# EAGLE design RH049.2 (EAGLE 7.7.0)
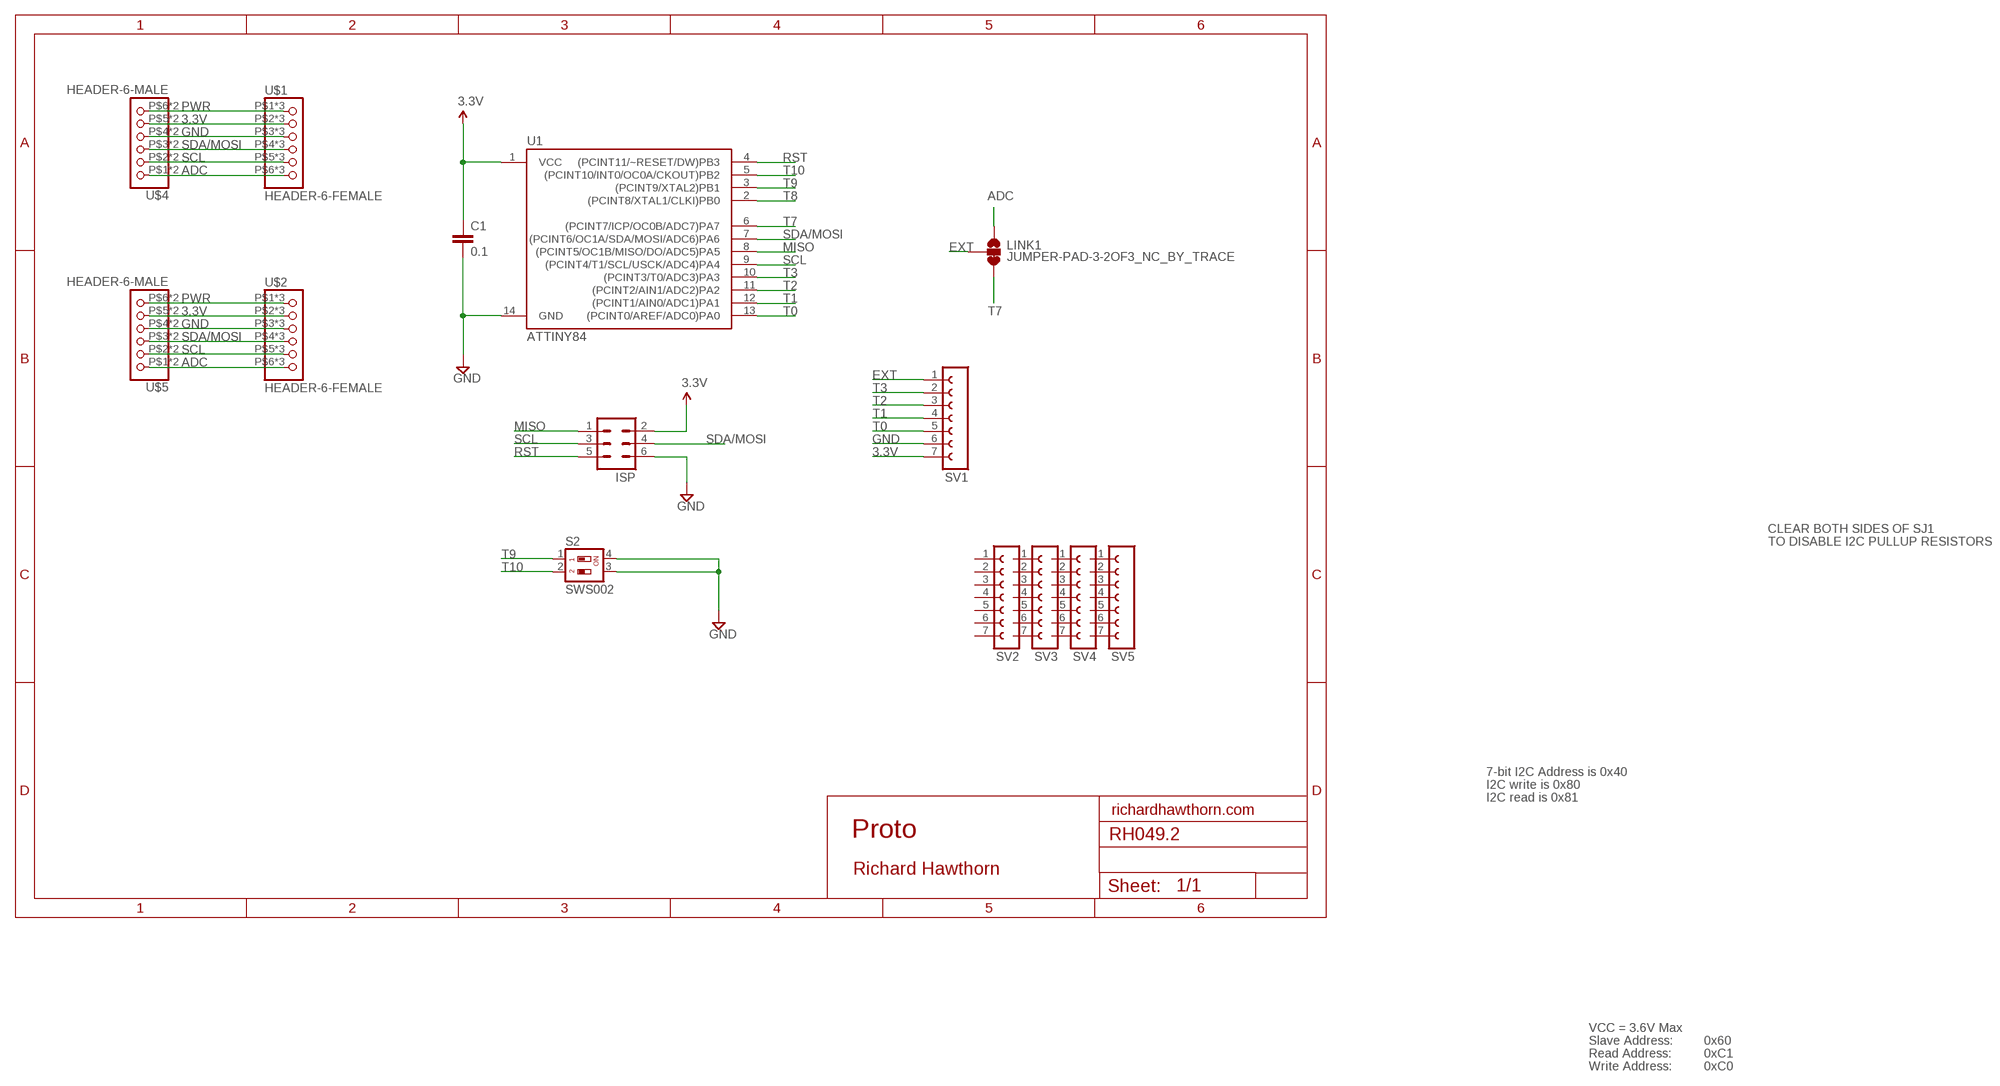
[diagram p0: schematic, sheet 1]

## Parts
C1  0.1  CAP0603-CAP  [0603-CAP]
ISP  MA03-2  [MA03-2]
LINK1  JUMPER-PAD-3-2OF3_NC_BY_TRACE  [PAD-JUMPER-3-2OF3_NC_BY_TRACE_YES_SILK_FULL_BOX]
S2  SWS002  [SMS-002]
SV1  FE07-1  [FE07]
SV2  FE07-1  [FE07]
SV3  FE07-1  [FE07]
SV4  FE07-1  [FE07]
SV5  FE07-1  [FE07]
U1  ATTINY84  [SO14]
U$1  HEADER-6-FEMALE  [2MMHEADER6]
U$2  HEADER-6-FEMALE  [2MMHEADER6]
U$4  HEADER-6-MALE  [2MMHEADERPIN6]
U$5  HEADER-6-MALE  [2MMHEADERPIN6]

## Nets
3.3V: C1.1 ISP.2 SV1.7 U1.1(VCC) U$1.P$2 U$1.P$10 U$1.P$18 U$2.P$2 U$2.P$10 U$2.P$18 U$4.P$5 U$4.P$13 U$5.P$5 U$5.P$13
ADC: LINK1.1 U$1.P$6 U$1.P$14 U$1.P$22 U$2.P$6 U$2.P$14 U$2.P$22 U$4.P$1 U$4.P$9 U$5.P$1 U$5.P$9
EXT: LINK1.2 SV1.1
GND [power]: C1.2 ISP.6 S2.3 S2.4 SV1.6 U1.14(GND) U$1.P$3 U$1.P$11 U$1.P$19 U$2.P$3 U$2.P$11 U$2.P$19 U$4.P$4 U$4.P$12 U$5.P$4 U$5.P$12
MISO: ISP.1 U1.8((PCINT5/OC1B/MISO/DO/ADC5)PA5)
PWR [power]: U$1.P$1 U$1.P$9 U$1.P$17 U$2.P$1 U$2.P$9 U$2.P$17 U$4.P$6 U$4.P$14 U$5.P$6 U$5.P$14
RST: ISP.5 U1.4((PCINT11/~RESET/DW)PB3)
SCL: ISP.3 U1.9((PCINT4/T1/SCL/USCK/ADC4)PA4) U$1.P$5 U$1.P$13 U$1.P$21 U$2.P$5 U$2.P$13 U$2.P$21 U$4.P$2 U$4.P$10 U$5.P$2 U$5.P$10
SDA/MOSI: ISP.4 U1.7((PCINT6/OC1A/SDA/MOSI/ADC6)PA6) U$1.P$4 U$1.P$12 U$1.P$20 U$2.P$4 U$2.P$12 U$2.P$20 U$4.P$3 U$4.P$11 U$5.P$3 U$5.P$11
T0: SV1.5 U1.13((PCINT0/AREF/ADC0)PA0)
T1: SV1.4 U1.12((PCINT1/AIN0/ADC1)PA1)
T2: SV1.3 U1.11((PCINT2/AIN1/ADC2)PA2)
T3: SV1.2 U1.10((PCINT3/T0/ADC3)PA3)
T7: LINK1.3 U1.6((PCINT7/ICP/OC0B/ADC7)PA7)
T8: U1.2((PCINT8/XTAL1/CLKI)PB0)
T9: S2.1 U1.3((PCINT9/XTAL2)PB1)
T10: S2.2 U1.5((PCINT10/INT0/OC0A/CKOUT)PB2)
Unconnected: SV2.1 SV2.2 SV2.3 SV2.4 SV2.5 SV2.6 SV2.7 SV3.1 SV3.2 SV3.3 SV3.4 SV3.5 SV3.6 SV3.7 SV4.1 SV4.2 SV4.3 SV4.4 SV4.5 SV4.6 SV4.7 SV5.1 SV5.2 SV5.3 SV5.4 SV5.5 SV5.6 SV5.7

## Notes on the sheet
- CLEAR BOTH SIDES OF SJ1
- TO DISABLE I2C PULLUP RESISTORS
- 7-bit I2C Address is 0x40
- I2C write is 0x80
- I2C read is 0x81
- richardhawthorn.com
- Proto
- Richard Hawthorn
- VCC = 3.6V Max
- Slave Address: | 0x60
- Read Address: | 0xC1
- Write Address: | 0xC0

## Library data of the parts
C1 = LowPowerLab:CAP: Capacitor Standard 0603 ceramic capacitor, and 0.1" leaded capacitor.
ISP = Richards:MA03-2: PIN HEADER; OC_FARNELL: unknown; OC_NEWARK: unknown
LINK1 = SparkFun-Passives:JUMPER-PAD-3-2OF3_NC_BY_TRACE
S2 = smd-special:SWS002: SMD Dip Switch 2 pol.
SV1-SV5 = con-lsta:FE07-1: FEMALE HEADER; OC_FARNELL: unknown; OC_NEWARK: unknown
U1 = SparkFun-DigitalIC:ATTINY84: Atmel 14-pin 2/4/8kB flash uC
U$1 U$2 = Richards:HEADER-6-FEMALE
U$4 U$5 = Richards:HEADER-6-MALE

## Net classes
1 power: width 0.381 mm, clearance 0.254 mm

## Board
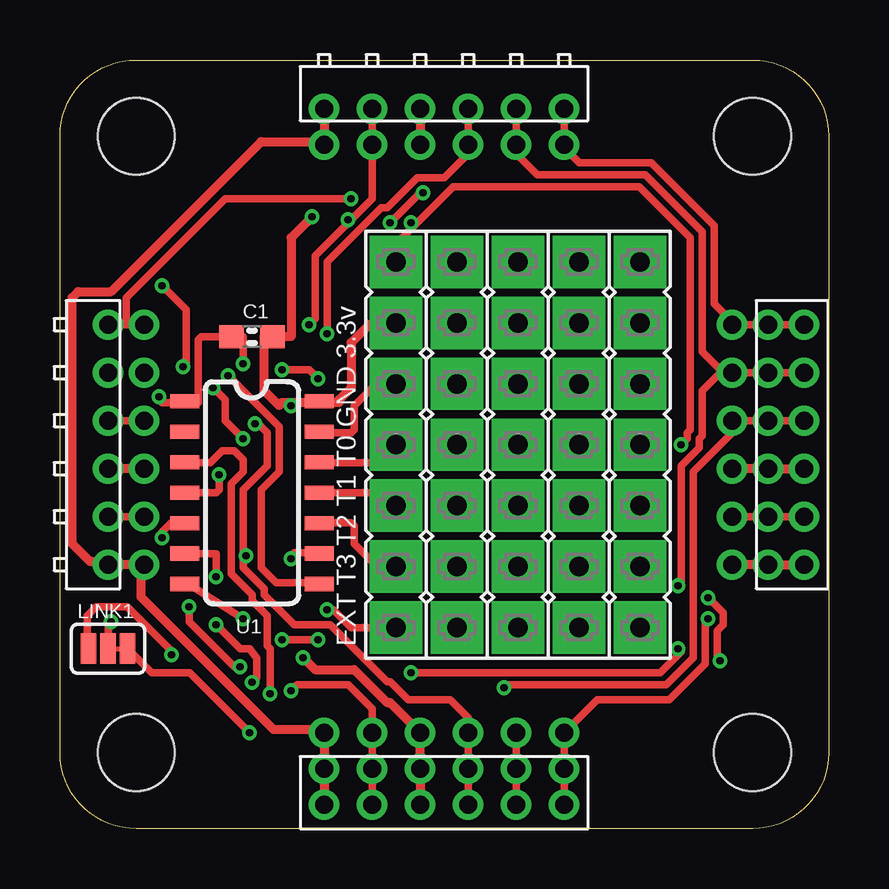
[diagram p1: board, top side]
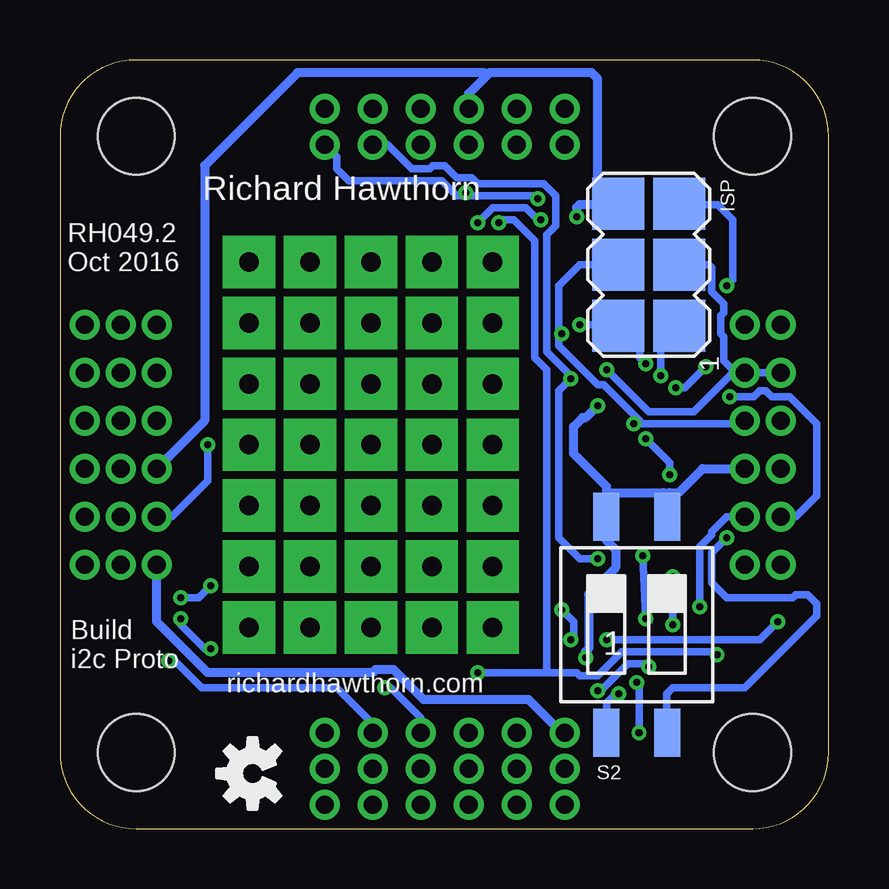
[diagram p2: board, bottom side, seen from below]

Size 32.03 x 32.03 mm. Coordinates in mm from the lower left corner, seen from the top.
Outline: 0,3.17 0,28.86 arc-90 3.17,32.03 28.86,32.03 arc-90 32.03,28.86 32.03,3.17 arc-90 28.86,0 3.17,0 arc-90 0,3.17
Copper layers (1*16): Top 0.035mm / dielectric 1.5mm / Bottom 0.035mm
Design rules "ITEADstudio_DRC *": minimum track width 12mil, minimum drill 12mil, track to track 6mil, track to pad 6mil, pad to pad 6mil, via to via 6mil, smd to smd 0mil, copper to edge 10mil, drill to drill 10mil, minimum pad ring 10mil, minimum via ring 6mil, stop-mask expansion 2mil, vias tented up to drill 100mil, thermal gap 15mil
Holes 3.2 mm at 3.17,3.17 28.86,3.17 3.17,28.86 28.86,28.86
tRestrict: area 0,0 to 5.7,5.7; area 26.3,0 to 32,5.7; area 26.3,26.3 to 32,32; area 0,26.3 to 5.7,32
bRestrict: area 0,26.3 to 5.7,32; area 26.3,26.3 to 32,32; area 26.3,0 to 32,5.7; area 0,0 to 5.7,5.7

### Footprints (pad centres in the part's own frame; a part is rotated, then mirrored left to right if it is on the bottom)
0603-CAP = smd 1.016 x 0.965: 1 -0.85,0; 2 0.85,0
MA03-2 = smd 2.159 x 2.159: 1 -2.54,-1.27; 2 -2.54,1.27; 3 0,-1.27; 4 0,1.27; 5 2.54,-1.27; 6 2.54,1.27
PAD-JUMPER-3-2OF3_NC_BY_TRACE_YES_SILK_FULL_BOX = smd 0.635 x 1.27: 1 -0.813,0; 2 0,0; 3 0.813,0
SMS-002 = smd 1.092 x 2.007: 1 -1.27,-4.496; 2 1.27,-4.496; 3 1.27,4.496; 4 -1.27,4.496
FE07 = drill 0.813 pad 2.184 square: 1 -7.62,0; 2 -5.08,0; 3 -2.54,0; 4 0,0; 5 2.54,0; 6 5.08,0; 7 7.62,0
SO14 = smd 0.6 x 1.2: 1 -3.81,-2.8; 2 -2.54,-2.8; 3 -1.27,-2.8; 4 0,-2.8; 5 1.27,-2.8; 6 2.54,-2.8; 7 3.81,-2.8; 8 3.81,2.8; 9 2.54,2.8; 10 1.27,2.8; 11 0,2.8; 12 -1.27,2.8; 13 -2.54,2.8; 14 -3.81,2.8
2MMHEADER6 = drill 0.75: P$1 1,5; P$2 1,3; P$3 1,1; P$4 1,-1; P$5 1,-3; P$6 1,-5; P$9 -0.5,5; P$10 -0.5,3; P$11 -0.5,1; P$12 -0.5,-1; P$13 -0.5,-3; P$14 -0.5,-5; P$17 -2,5; P$18 -2,3; P$19 -2,1; P$20 -2,-1; P$21 -2,-3; P$22 -2,-5
2MMHEADERPIN6 = drill 0.75: P$1 1,5; P$2 1,3; P$3 1,1; P$4 1,-1; P$5 1,-3; P$6 1,-5; P$9 -0.5,5; P$10 -0.5,3; P$11 -0.5,1; P$12 -0.5,-1; P$13 -0.5,-3; P$14 -0.5,-5

### Placement (x,y rotation side)
C1  8,20.5 0 top
ISP  7.5,23.5 90 bottom
LINK1  2,7.5 0 top
S2  8,8.5 0 bottom
SV1  14,16 90 top
SV2  24.16,16 90 top
SV3  21.62,16 90 top
SV4  19.08,16 90 top
SV5  16.54,16 90 top
U1  8,14 270 top
U$1  16,3 90 top
U$2  29,16 180 top
U$3  [OSHW-LOGO-S]  24,2.3 90 bottom
U$4  16,29.5 270 top
U$5  2.5,16 0 top

### Tracks (layer width: path | path; a pad name or v marks a point on that pad's centre or on a via)
3.3V  (via drill 0.3)
  Top 0.305: U$2.P$2 U$2.P$10 U$2.P$18 | v25.88,16 26.12,16.25 26.12,16.5 26.25,16.62 26.25,24.62 24.12,26.75 16.38,26.75 14.81,25.19 | 14.81,25.19 14,24.38 SV1.7 | U$1.P$18 U$1.P$10 U$1.P$2 13,5 12,6 9.88,6 v9.62,5.75 | U$4.P$13 U$4.P$5 13,26.25 12.06,25.31 | U$5.P$13 U$5.P$5 | v7.62,19.38 7.62,20.5 C1.1 5.88,20.5 5.75,20.38 5.75,17.75 5.25,17.75 U1.1 5.12,17.75 4.25,17.75 4.12,17.88 v4.12,18 | 12.06,25.31 10.62,23.88 10.62,21.25 v10.38,21 | v7.5,6.75 7.25,6.75 5.38,8.62 v5.38,9.25 | v14.62,25.25 14.75,25.25 14.81,25.19 | v12,25.38 12.06,25.31
  Bottom 0.305: U$2.P$2 27.38,13 25.88,14.5 v25.88,16 | v7.62,19.38 7.88,19.62 7.88,20.88 8,21 8.75,21 ISP.2 8.88,21 v10.38,21 | U$5.P$13 1.38,13 0.5,13.88 0.5,16.88 1.62,18 2.38,18 2.62,18.25 2.88,18.25 3.12,18 v4.12,18 | v9.62,5.75 9.5,5.75 8.38,6.88 7.62,6.88 v7.5,6.75 | v5.38,9.25 5.38,11.75 4.88,12.25 4.88,12.38 4.25,13 U$5.P$5 | v14.62,25.25 14,25.88 12.62,25.88 12.12,25.38 v12,25.38
ADC  (via drill 0.3)
  Top 0.305: U$1.P$22 U$1.P$14 U$1.P$6 22.38,5.38 25.38,5.38 26.88,6.88 26.88,8.62 v27,8.75 | v4.65,7.25 4.55,7.5 2.8,9.25 1.5,9.25 1.12,8.88 1.12,7.5 LINK1.1 | v14.62,6.5 25,6.5 25.88,7.38 v25.75,7.5 | U$2.P$22 U$2.P$14 U$2.P$6 28,21.12 27.25,21.88 27.25,25.12 24.62,27.75 21.62,27.75 21,28.38 U$4.P$1 U$4.P$9 | U$5.P$1 2.75,21 | 2.75,21 U$5.P$9 | 2.75,21 2.75,22.12 6.88,26.25 v12.12,26.25 | v13.75,25.25 15,26.5 v15.12,26.5
  Bottom 0.305: v4.65,7.25 4.88,7.38 8.62,7.38 9.62,6.38 10.38,6.38 10.5,6.5 11.75,6.5 | v14.62,6.5 11.75,6.5 | v25.75,7.5 26,7.5 27,8.5 v27,8.75 | v12.12,26.25 12.25,26.38 15.12,26.38 | 15.12,26.38 15.5,26.38 16.12,27 20,27 20.5,27.5 20.5,28 U$4.P$1 | 11.75,6.5 11.75,19.12 12.25,19.62 12.25,24.5 13.12,25.38 13.62,25.38 v13.75,25.25 | v15.12,26.5 15.12,26.38
EXT  (via drill 0.3)
  Top 0.305: v11.12,9.12 11.38,9.12 12.12,8.38 SV1.1 | v9.25,7.88 v10.75,7.88 | v2.12,8.62 2,8.5 LINK1.2
  Bottom 0.305: v11.12,9.12 10.62,8.62 10.62,8 v10.75,7.88 | v9.25,7.88 2.88,7.88 v2.12,8.62
GND  (via drill 0.3)
  Top 0.381: U$2.P$3 U$2.P$11 U$2.P$19 | U$4.P$12 U$4.P$4 | U$1.P$19 U$1.P$11 U$1.P$3 13.75,5.25 13.62,5.25 12.25,6.62 10.62,6.62 v10.12,7.12 | U$5.P$4 U$5.P$12 | 9.62,17.75 10.75,17.75 U1.14 10.88,17.75 11.62,17.75 11.62,17.88 12.12,18.38 12.12,20.25 12.88,21 14,21 SV1.6 | 9.62,17.75 9.25,17.75 9.12,17.62 8.5,18.25 8.5,20.5 C1.2 9.62,20.5 9.62,24.62 v10.5,25.5 | v9.62,17.62 9.62,17.75
  Bottom 0.381: v9.62,17.62 10.12,17.12 10.25,17.12 10.62,16.75 10.62,15.62 9.25,14.25 9.25,14 | 9.25,14 9.25,13 S2.4 9.25,12.88 9.25,12 8.88,11.62 8.88,10.88 10,9.75 10,7.5 10.12,7.38 v10.12,7.12 | 6.75,13.88 6.75,13 S2.3 | 6.75,13.88 6.88,14 9.25,14 | U$5.P$4 5.25,15 6.25,14 6.62,14 6.75,13.88 | v10.5,25.5 10.5,25.88 10.38,26 8.88,26 ISP.6 9.62,26.12 9.62,31.25 9.88,31.5 14.12,31.5 14.25,31.38 | U$4.P$12 15,30.62 14.25,31.38 | U$2.P$3 26,17 26,27.62 22.12,31.5 14.38,31.5 14.25,31.38
MISO  (via drill 0.3)
  Top 0.305: v7,18.88 9.12,16.75 9.12,14.88 8.38,14.12 8.38,10.88 9,10.25 10.75,10.25 U1.8
  Bottom 0.305: v7,18.88 7,21 6.25,21 ISP.1
PWR
  Top 0.381: U$2.P$1 U$2.P$9 U$2.P$17 | U$4.P$14 U$4.P$6 10.88,28.62 8.38,28.62 2.12,22.38 0.75,22.38 0.5,22.12 0.5,11.88 1.25,11.12 1.88,11.12 U$5.P$14 U$5.P$6 3.38,10.88 3.38,9.65 8.9,4.12 10.88,4.12 U$1.P$1 U$1.P$9 U$1.P$17
  Bottom 0.381: U$2.P$1 28,8.62 25.88,6.5 19,6.5 18.88,6.62 18.12,6.62 16.88,5.38 12.5,5.38 11.12,4 U$1.P$1
RST  (via drill 0.3)
  Top 0.305: U1.4 6.5,14 6.62,14.12 v6.62,14.75 | v7.62,16.25 6.88,17 6.88,17.88 v6.38,18.38 | v5.12,19.25 5.25,19.38 5.25,21.62 v4.25,22.62
  Bottom 0.305: v6.62,14.75 6.62,15.25 v7.62,16.25 | v6.38,18.38 6,18.38 v5.12,19.25 | v4.25,22.62 4,22.88 4,25.38 4.62,26 6.12,26 ISP.5
SCL  (via drill 0.3)
  Top 0.305: v9.62,11.25 9.62,11.38 9.75,11.5 10.75,11.5 U1.9 | v10.75,18.75 10.38,19.12 v9.25,19.12 | U$1.P$5 U$1.P$13 U$1.P$21 | U$4.P$10 U$4.P$2 19,28.12 19.88,27.25 24.38,27.25 26.75,24.88 26.75,19.88 27.62,19 U$2.P$5 | U$2.P$5 U$2.P$13 U$2.P$21 | v27.5,7 27.38,7.12 27.38,8.25 27.62,8.5 27.62,9 v27,9.62 | v25.75,10.12 25.88,10.25 25.88,15.12 26.62,15.88 26.62,16.25 26.75,16.38 26.75,18.25 27.5,19 U$2.P$5
  Bottom 0.305: v9.62,11.25 10.38,11.25 11.25,12.12 11.25,18.25 v10.75,18.75 10.75,18.88 11.75,19.88 11.75,24.75 11.38,25.12 11.38,26.38 11.88,26.88 14.62,26.88 14.88,27.12 15.5,27.12 16,27.62 16.5,27.62 16.62,27.5 17.38,27.5 18.38,28.5 U$4.P$2 | v9.25,19.12 7.5,17.38 5.62,17.38 4,19 U$5.P$2 | ISP.3 5,23.5 4.88,23.38 4.88,22.38 4.38,21.88 4.38,21.5 4.5,21.38 4.5,20.62 4.38,20.5 4.38,19.5 4,19.12 U$5.P$2 | U$5.P$2 U$5.P$10 | U$1.P$5 19,4.38 20.5,5.88 26.12,5.88 27.25,7 v27.5,7 | v27,9.62 26.25,9.62 v25.75,10.12
SDA/MOSI  (via drill 0.3)
  Top 0.305: U$1.P$20 U$1.P$12 U$1.P$4 17,4.62 16.25,5.38 14.5,5.38 13.75,6.12 13.62,6.12 11.25,8.5 9.75,8.5 8.5,9.75 8.5,10 7.62,10.88 7.62,11.38 v7.75,11.38 7.62,11.5 7.62,14.12 8.62,15.12 8.62,16.5 8.25,16.88 v8.12,16.88 | U$2.P$20 U$2.P$12 U$2.P$4 28,16.5 26.38,14.88 26.38,7.12 25.25,6 18.62,6 v18.5,5.88 | U$4.P$11 U$4.P$3 17,28.12 16,27.12 14.88,27.12 13.62,25.88 13.38,25.88 11.12,23.62 v11.12,20.62 | U$5.P$11 U$5.P$3 | v7.62,8.75 5.25,10.25 U1.7
  Bottom 0.305: U$1.P$4 17,4.62 18.25,5.88 v18.5,5.88 | v7.75,11.38 v7.62,8.75 | U$5.P$3 3.62,16.88 v8.12,16.88 7.88,17 9.38,18.5 9.62,18.5 11.25,20.12 11.25,20.62 | ISP.4 10.38,23.5 11.25,22.62 11.25,20.62 | v11.12,20.62 11.25,20.62
T0
  Top 0.305: U1.13 10.88,16.5 12.12,16.5 12.25,16.62 12.25,17.62 13.12,18.5 14,18.5 SV1.5
T1
  Top 0.305: SV1.4 13.25,15.25 10.88,15.25 U1.12
T2
  Top 0.305: U1.11 13.5,14 14,13.5 SV1.3
T3
  Top 0.305: U1.10 10.88,12.75 12.12,12.75 12.25,12.62 12.25,11.88 13.12,11 14,11 SV1.2
T7  (via drill 0.3)
  Top 0.305: U1.6 6.5,11.46 v6.5,10.5 | v6.5,8.5 7.5,7.5 7.9,7.5 8.2,7.1 8.2,6.3 v8,6.1 | v7.9,4 5.4,6.5 3.81,6.5 LINK1.3
  Bottom 0.305: v6.5,10.5 v6.5,8.5 | v8,6.1 7.9,6 v7.9,4
T9  (via drill 0.3)
  Top 0.305: v8.75,5.62 8.75,7.5 8.62,7.62 8.62,8.88 8,9.5 8,9.75 7.12,10.62 7.12,14.38 7.62,14.88 7.62,15.38 7.25,15.75 6.75,15.75 6.25,15.25 5.25,15.25 U1.3
  Bottom 0.305: v8.75,5.62 8.88,5.62 9.25,5.25 9.25,4.12 S2.1
T10  (via drill 0.3)
  Top 0.305: v4.25,12.12 4.25,12.38 4.62,12.75 5.12,12.75 U1.5
  Bottom 0.305: v4.25,12.12 4.88,11.5 4.88,10.25 4.25,9.62 1.5,9.62 1.38,9.75 0.88,9.75 0.5,9.38 0.5,8.88 3.5,5.88 6.5,5.88 6.75,5.62 6.75,4.12 S2.2

### Text on the board
tPlace: EXT T3 T2 T1 T0 GND 3.3v
bPlace: Richard Hawthorn | RH049.2 / Oct 2016 | Build / i2c Proto | richardhawthorn.com
tDocu: REG